# EAGLE design electrosteel2020_10_arrange6_synthboardsonlyrev6 (EAGLE 9.6.2)

## Sheet 1 of 2
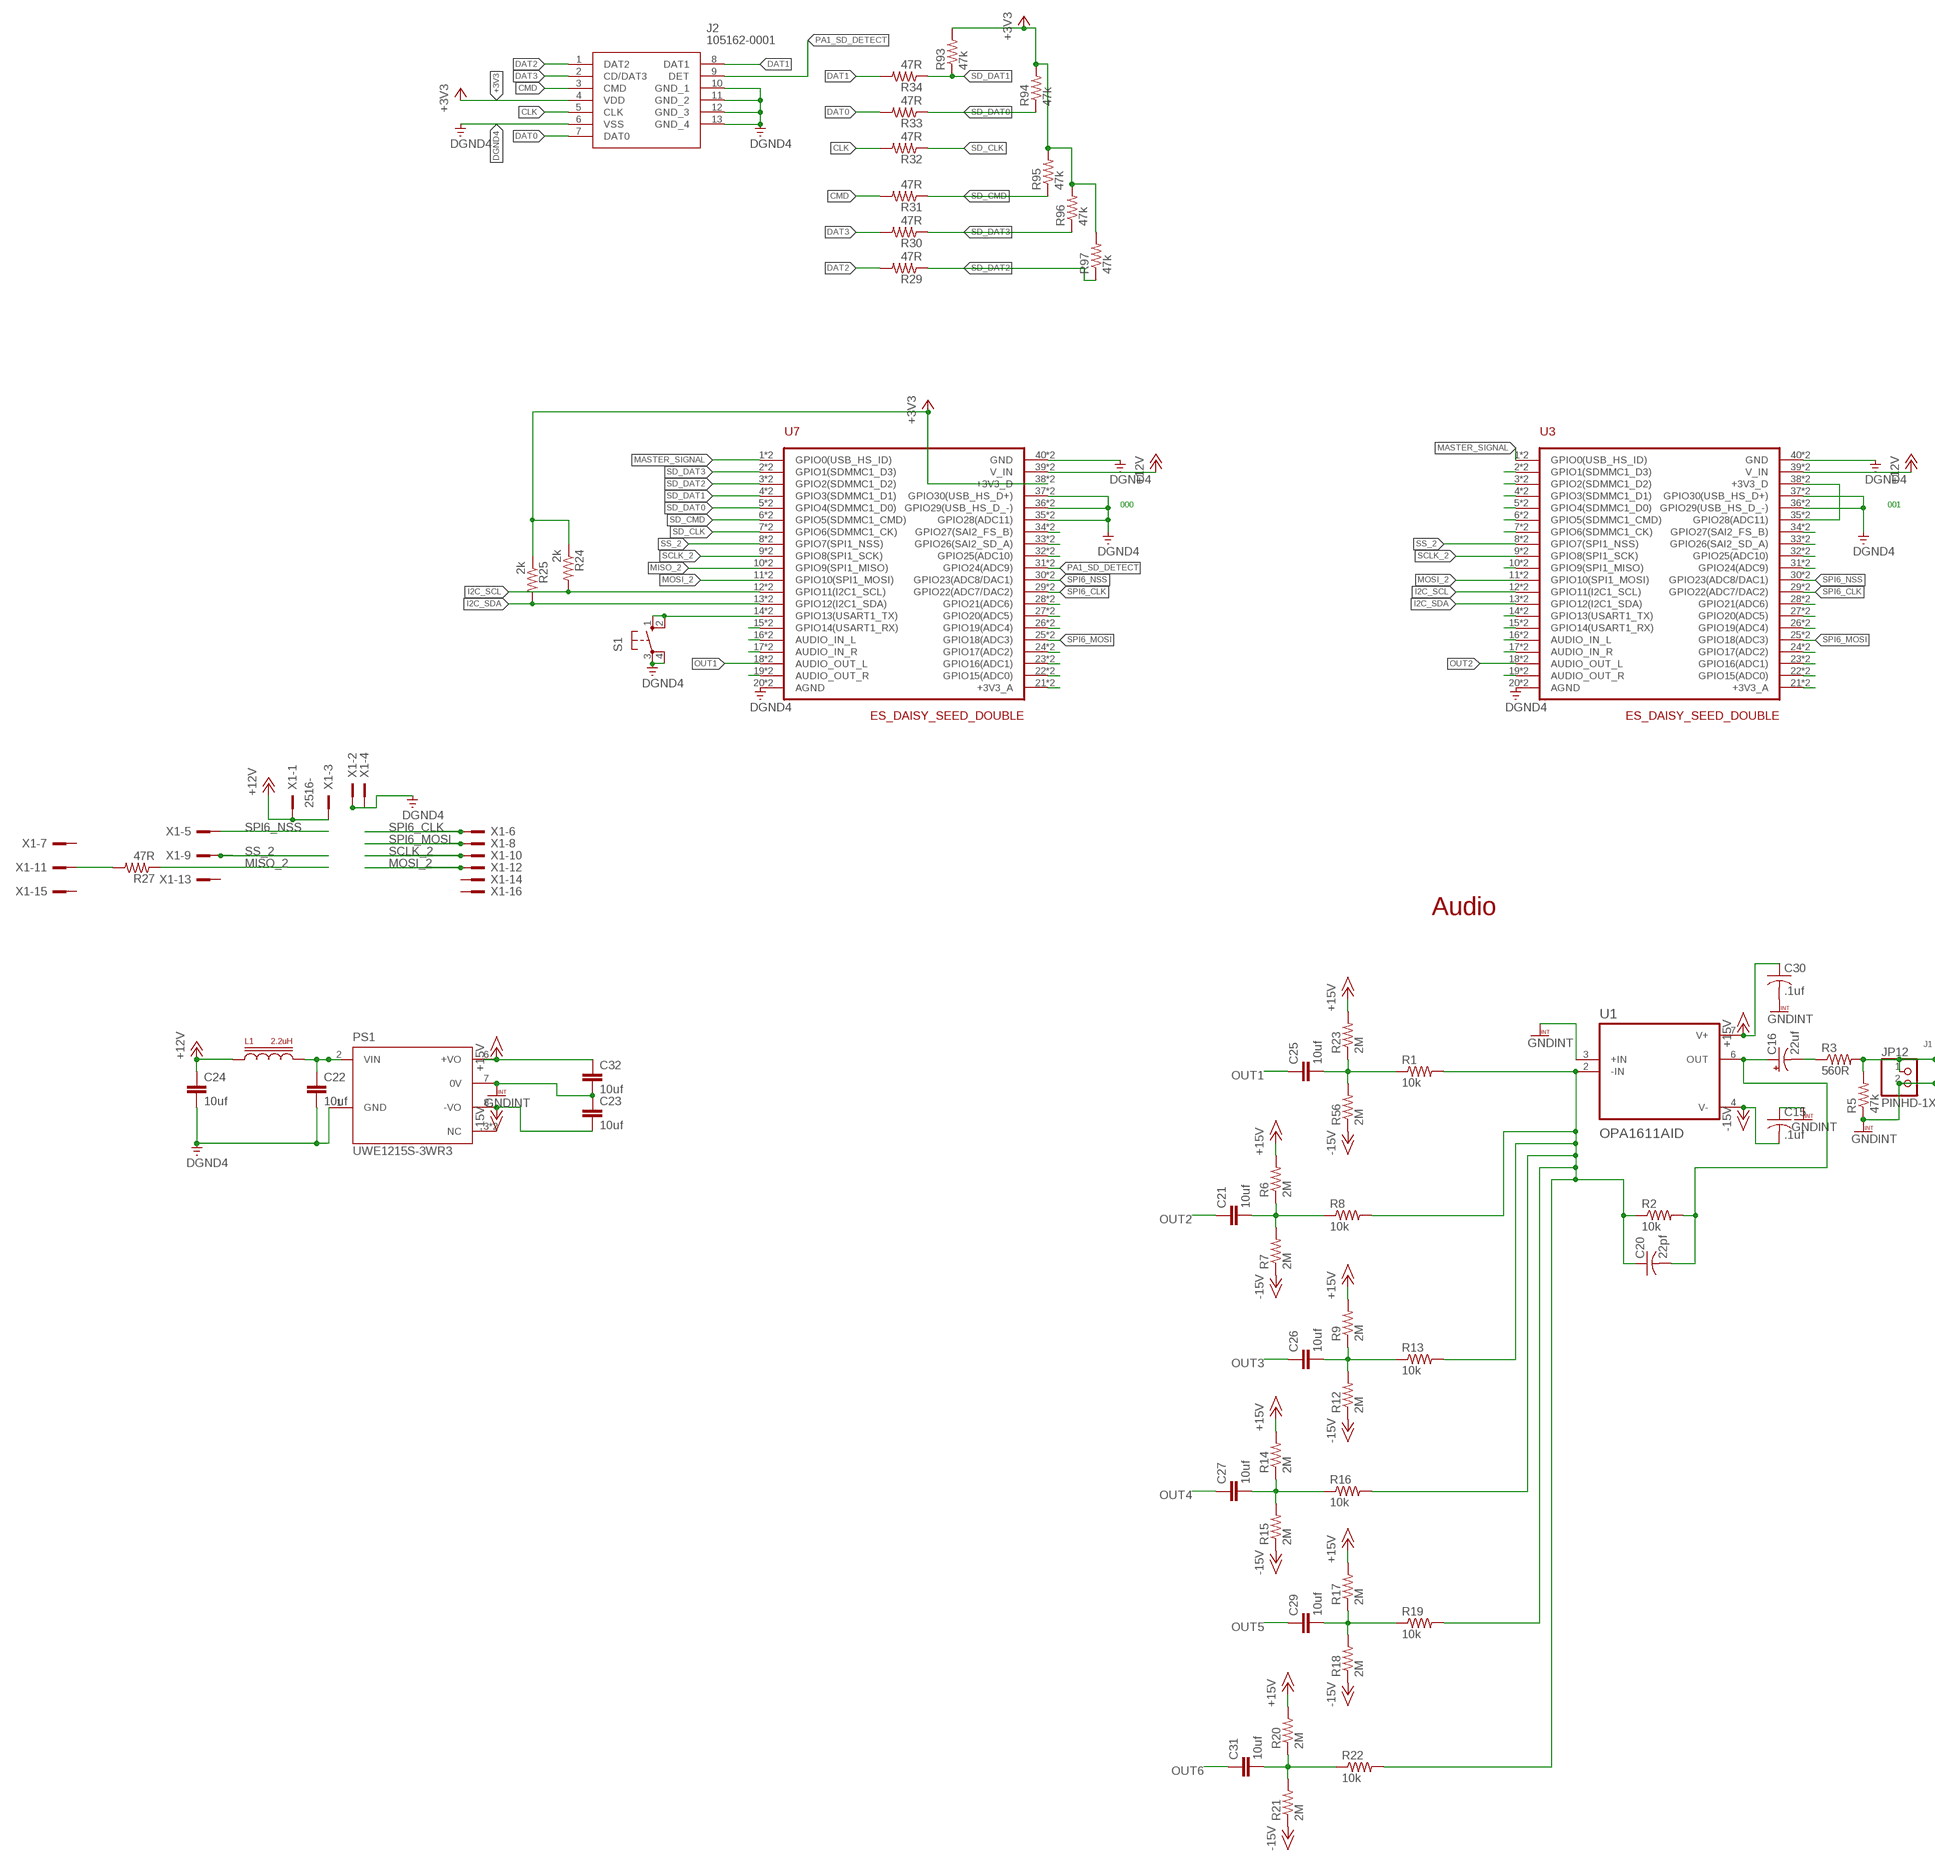
[diagram p0: schematic, sheet 1, part 1 of 2]
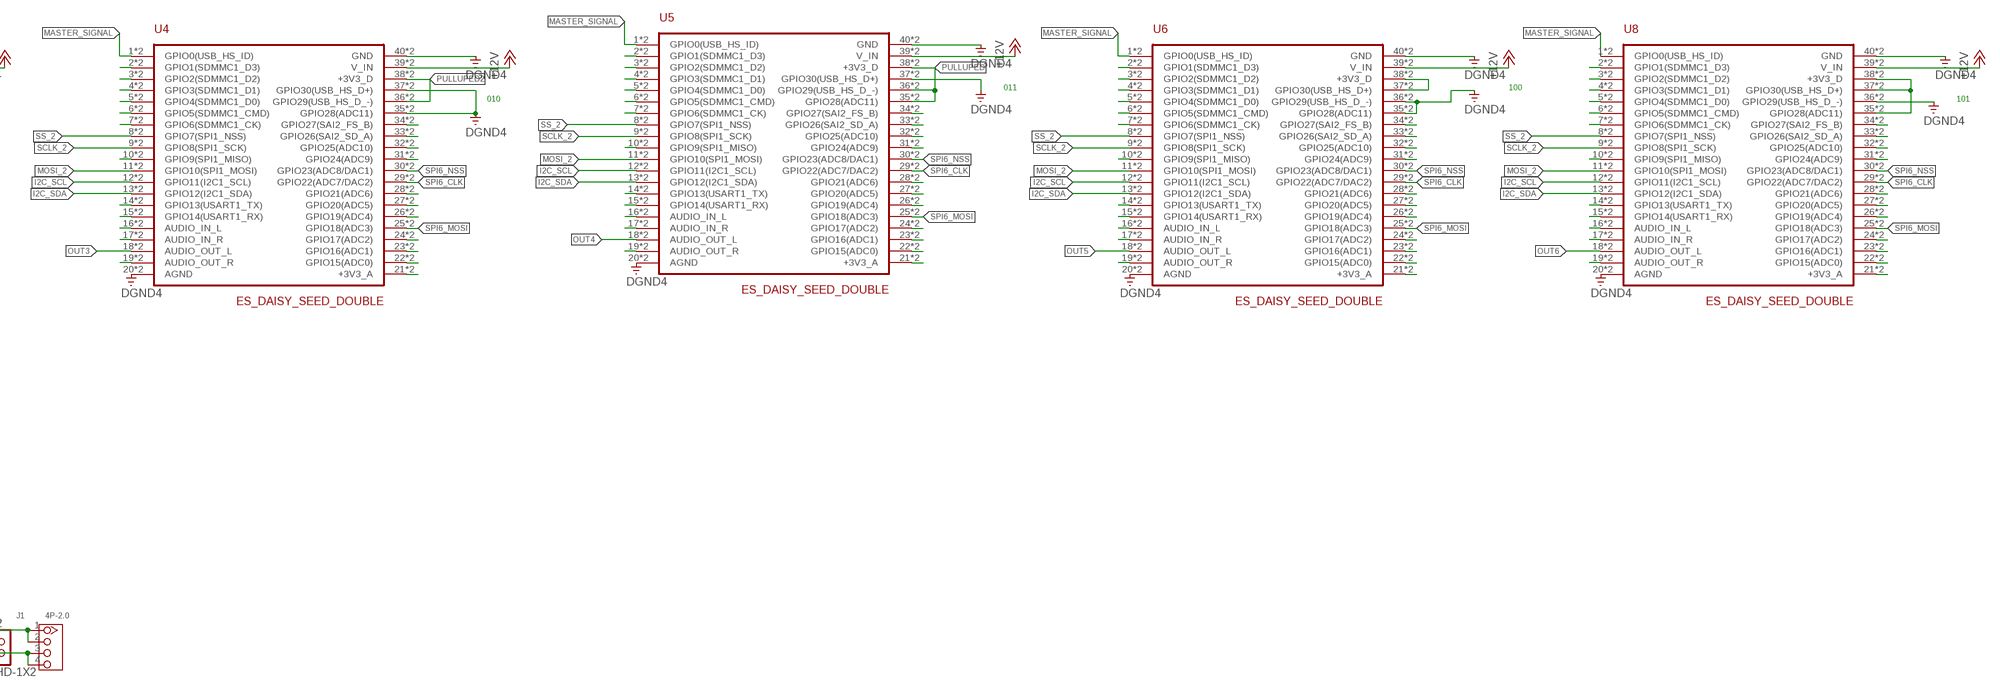
[diagram p1: schematic, sheet 1, part 2 of 2]

### Parts
C15  .1uf  C-USC0603K  [C0603K]
C16  22uf  CPOL-USD  [PANASONIC_D]
C20  22pf  C-USC0603  [C0603]
C21  10uf  C-EUC1206K  [C1206K]
C22  10uf  C-EUC1206K  [C1206K]
C23  10uf  C-EUC1206K  [C1206K]
C24  10uf  C-EUC1206K  [C1206K]
C25  10uf  C-EUC1206K  [C1206K]
C26  10uf  C-EUC1206K  [C1206K]
C27  10uf  C-EUC1206K  [C1206K]
C29  10uf  C-EUC1206K  [C1206K]
C30  .1uf  C-USC0603K  [C0603K]
C31  10uf  C-EUC1206K  [C1206K]
C32  10uf  C-EUC1206K  [C1206K]
J1  4P-2.0  GROVE-CONNECTOR-DIP(4P-2.0)  [HW4-2.0]
J2  105162-0001  [105162-0001]
JP12  PINHD-1X2  [1X02]
L1  2.2uH  INDUCTORS  [BOURNS_SRP2010]
PS1  UWE1215S-3WR3  [CONV_UWE1215S-3WR3]
R1  10k  R-US_R0603  [R0603]
R2  10k  R-US_R0603  [R0603]
R3  560R  R-US_R0603  [R0603]
R5  47k  R-US_R0603  [R0603]
R6  2M  R-US_R0603  [R0603]
R7  2M  R-US_R0603  [R0603]
R8  10k  R-US_R0603  [R0603]
R9  2M  R-US_R0603  [R0603]
R12  2M  R-US_R0603  [R0603]
R13  10k  R-US_R0603  [R0603]
R14  2M  R-US_R0603  [R0603]
R15  2M  R-US_R0603  [R0603]
R16  10k  R-US_R0603  [R0603]
R17  2M  R-US_R0603  [R0603]
R18  2M  R-US_R0603  [R0603]
R19  10k  R-US_R0603  [R0603]
R20  2M  R-US_R0603  [R0603]
R21  2M  R-US_R0603  [R0603]
R22  10k  R-US_R0603  [R0603]
R23  2M  R-US_R0603  [R0603]
R24  2k  R-US_R0603  [R0603]
R25  2k  R-US_R0603  [R0603]
R27  47R  R-US_R0603  [R0603]
R29  47R  R-US_R0603  [R0603]
R30  47R  R-US_R0603  [R0603]
R31  47R  R-US_R0603  [R0603]
R32  47R  R-US_R0603  [R0603]
R33  47R  R-US_R0603  [R0603]
R34  47R  R-US_R0603  [R0603]
R56  2M  R-US_R0603  [R0603]
R93  47k  R-US_R0603  [R0603]
R94  47k  R-US_R0603  [R0603]
R95  47k  R-US_R0603  [R0603]
R96  47k  R-US_R0603  [R0603]
R97  47k  R-US_R0603  [R0603]
S1  10-XX  [B3F-10XX]
U1  OPA1611AID  [SOIC127P599X175-8N]
U3  ES_DAISY_SEED_DOUBLE  [ES_DAISY_SEED_DOUBLE]
U4  ES_DAISY_SEED_DOUBLE  [ES_DAISY_SEED_DOUBLE]
U5  ES_DAISY_SEED_DOUBLE  [ES_DAISY_SEED_DOUBLE]
U6  ES_DAISY_SEED_DOUBLE  [ES_DAISY_SEED_DOUBLE]
U7  ES_DAISY_SEED_DOUBLE  [ES_DAISY_SEED_DOUBLE]
U8  ES_DAISY_SEED_DOUBLE  [ES_DAISY_SEED_DOUBLE]
X1  2516-  [PAK100/2500-16]

### Nets
+3V3: J2.4(VDD) R24.1 R25.1 R93.2 R94.2 R95.2 R96.2 R97.2 U7.38(+3V3_D) U7.B38(+3V3_D)
+12V: C24.1 L1.P$1 U3.39(V_IN) U3.B39(V_IN) U4.39(V_IN) U4.B39(V_IN) U5.39(V_IN) U5.B39(V_IN) U6.39(V_IN) U6.B39(V_IN) U7.39(V_IN) U7.B39(V_IN) U8.39(V_IN) U8.B39(V_IN) X1.1 X1.3
+15V: C30.1 C32.1 PS1.6(+VO) R6.2 R9.2 R14.2 R17.2 R20.2 R23.2 U1.7(V+)
-15V: C15.2 C23.2 PS1.8(-VO) R7.1 R12.1 R15.1 R18.1 R21.1 R56.1 U1.4(V-)
CLK: J2.5(CLK) R32.2
CMD: J2.3(CMD) R31.2
DAT0: J2.7(DAT0) R33.2
DAT1: J2.8(DAT1) R34.2
DAT2: J2.1(DAT2) R29.2
DAT3: J2.2(CD/DAT3) R30.2
DGND4: C22.2 C24.2 J2.6(VSS) J2.10(GND_1) J2.11(GND_2) J2.12(GND_3) J2.13(GND_4) PS1.1(GND) S1.3(P) S1.4(P1) U3.20(AGND) U3.36(GPIO29(USB_HS_D_-)) U3.37(GPIO30(USB_HS_D+)) U3.40(GND) U3.B20(AGND) U3.B36(GPIO29(USB_HS_D_-)) U3.B37(GPIO30(USB_HS_D+)) U3.B40(GND) U4.20(AGND) U4.35(GPIO28(ADC11)) U4.37(GPIO30(USB_HS_D+)) U4.40(GND) U4.B20(AGND) U4.B35(GPIO28(ADC11)) U4.B37(GPIO30(USB_HS_D+)) U4.B40(GND) U5.20(AGND) U5.37(GPIO30(USB_HS_D+)) U5.40(GND) U5.B20(AGND) U5.B37(GPIO30(USB_HS_D+)) U5.B40(GND) U6.20(AGND) U6.35(GPIO28(ADC11)) U6.36(GPIO29(USB_HS_D_-)) U6.40(GND) U6.B20(AGND) U6.B35(GPIO28(ADC11)) U6.B36(GPIO29(USB_HS_D_-)) U6.B40(GND) U7.20(AGND) U7.35(GPIO28(ADC11)) U7.36(GPIO29(USB_HS_D_-)) U7.37(GPIO30(USB_HS_D+)) U7.40(GND) U7.B20(AGND) U7.B35(GPIO28(ADC11)) U7.B36(GPIO29(USB_HS_D_-)) U7.B37(GPIO30(USB_HS_D+)) U7.B40(GND) U8.20(AGND) U8.36(GPIO29(USB_HS_D_-)) U8.40(GND) U8.B20(AGND) U8.B36(GPIO29(USB_HS_D_-)) U8.B40(GND) X1.2 X1.4
GNDINT: C15.1 C23.1 C30.2 C32.2 J1.3 J1.4 JP12.2 PS1.7(0V) R5.1 U1.3(+IN)
I2C_SCL: R24.2 U3.12(GPIO11(I2C1_SCL)) U3.B12(GPIO11(I2C1_SCL)) U4.12(GPIO11(I2C1_SCL)) U4.B12(GPIO11(I2C1_SCL)) U5.12(GPIO11(I2C1_SCL)) U5.B12(GPIO11(I2C1_SCL)) U6.12(GPIO11(I2C1_SCL)) U6.B12(GPIO11(I2C1_SCL)) U7.12(GPIO11(I2C1_SCL)) U7.B12(GPIO11(I2C1_SCL)) U8.12(GPIO11(I2C1_SCL)) U8.B12(GPIO11(I2C1_SCL))
I2C_SDA: R25.2 U3.13(GPIO12(I2C1_SDA)) U3.B13(GPIO12(I2C1_SDA)) U4.13(GPIO12(I2C1_SDA)) U4.B13(GPIO12(I2C1_SDA)) U5.13(GPIO12(I2C1_SDA)) U5.B13(GPIO12(I2C1_SDA)) U6.13(GPIO12(I2C1_SDA)) U6.B13(GPIO12(I2C1_SDA)) U7.13(GPIO12(I2C1_SDA)) U7.B13(GPIO12(I2C1_SDA)) U8.13(GPIO12(I2C1_SDA)) U8.B13(GPIO12(I2C1_SDA))
MASTER_SIGNAL: U3.1(GPIO0(USB_HS_ID)) U3.B1(GPIO0(USB_HS_ID)) U4.1(GPIO0(USB_HS_ID)) U4.B1(GPIO0(USB_HS_ID)) U5.1(GPIO0(USB_HS_ID)) U5.B1(GPIO0(USB_HS_ID)) U6.1(GPIO0(USB_HS_ID)) U6.B1(GPIO0(USB_HS_ID)) U7.1(GPIO0(USB_HS_ID)) U7.B1(GPIO0(USB_HS_ID)) U8.1(GPIO0(USB_HS_ID)) U8.B1(GPIO0(USB_HS_ID))
MISO_2: R27.1 U7.10(GPIO9(SPI1_MISO)) U7.B10(GPIO9(SPI1_MISO))
MISO_2_P1: U3.10(GPIO9(SPI1_MISO)) U3.B10(GPIO9(SPI1_MISO))
MISO_2_P2: U4.10(GPIO9(SPI1_MISO)) U4.B10(GPIO9(SPI1_MISO))
MISO_2_P3: U5.10(GPIO9(SPI1_MISO)) U5.B10(GPIO9(SPI1_MISO))
MISO_2_P4: U6.10(GPIO9(SPI1_MISO)) U6.B10(GPIO9(SPI1_MISO))
MISO_2_P5: U8.10(GPIO9(SPI1_MISO)) U8.B10(GPIO9(SPI1_MISO))
MONO_OUTPUT: C16.+ C20.2 R2.2 U1.6(OUT)
MOSI_2: U3.11(GPIO10(SPI1_MOSI)) U3.B11(GPIO10(SPI1_MOSI)) U4.11(GPIO10(SPI1_MOSI)) U4.B11(GPIO10(SPI1_MOSI)) U5.11(GPIO10(SPI1_MOSI)) U5.B11(GPIO10(SPI1_MOSI)) U6.11(GPIO10(SPI1_MOSI)) U6.B11(GPIO10(SPI1_MOSI)) U7.11(GPIO10(SPI1_MOSI)) U7.B11(GPIO10(SPI1_MOSI)) U8.11(GPIO10(SPI1_MOSI)) U8.B11(GPIO10(SPI1_MOSI)) X1.12
N$1: U5.31(GPIO24(ADC9)) U5.B31(GPIO24(ADC9))
N$2: C21.2 R6.1 R7.2 R8.1
N$3: U6.31(GPIO24(ADC9)) U6.B31(GPIO24(ADC9))
N$4: C20.1 R1.2 R2.1 R8.2 R13.2 R16.2 R19.2 R22.2 U1.2(-IN)
N$5: C16.- R3.1
N$6: J1.1 J1.2 JP12.1 R3.2 R5.2
N$7: C25.2 R1.1 R23.1 R56.2
N$8: C26.2 R9.1 R12.2 R13.1
N$9: C27.2 R14.1 R15.2 R16.1
N$10: C29.2 R17.1 R18.2 R19.1
N$11: C31.2 R20.1 R21.2 R22.1
N$12: U7.19(AUDIO_OUT_R) U7.B19(AUDIO_OUT_R)
N$13: U7.17(AUDIO_IN_R) U7.B17(AUDIO_IN_R)
N$14: U7.16(AUDIO_IN_L) U7.B16(AUDIO_IN_L)
N$15: U7.15(GPIO14(USART1_RX)) U7.B15(GPIO14(USART1_RX))
N$17: U8.31(GPIO24(ADC9)) U8.B31(GPIO24(ADC9))
N$18: U8.26(GPIO19(ADC4)) U8.B26(GPIO19(ADC4))
N$19: U6.26(GPIO19(ADC4)) U6.B26(GPIO19(ADC4))
N$20: U7.34(GPIO27(SAI2_FS_B)) U7.B34(GPIO27(SAI2_FS_B))
N$21: U7.33(GPIO26(SAI2_SD_A)) U7.B33(GPIO26(SAI2_SD_A))
N$22: U7.32(GPIO25(ADC10)) U7.B32(GPIO25(ADC10))
N$23: U5.26(GPIO19(ADC4)) U5.B26(GPIO19(ADC4))
N$24: R27.2 X1.11
N$25: U7.28(GPIO21(ADC6)) U7.B28(GPIO21(ADC6))
N$26: U7.27(GPIO20(ADC5)) U7.B27(GPIO20(ADC5))
N$27: U4.26(GPIO19(ADC4)) U4.B26(GPIO19(ADC4))
N$28: U3.26(GPIO19(ADC4)) U3.B26(GPIO19(ADC4))
N$29: U3.21(+3V3_A) U3.B21(+3V3_A)
N$30: U7.24(GPIO17(ADC2)) U7.B24(GPIO17(ADC2))
N$31: U7.23(GPIO16(ADC1)) U7.B23(GPIO16(ADC1))
N$32: U7.22(GPIO15(ADC0)) U7.B22(GPIO15(ADC0))
N$33: U3.19(AUDIO_OUT_R) U3.B19(AUDIO_OUT_R)
N$34: U3.17(AUDIO_IN_R) U3.B17(AUDIO_IN_R)
N$35: U3.16(AUDIO_IN_L) U3.B16(AUDIO_IN_L)
N$36: U3.15(GPIO14(USART1_RX)) U3.B15(GPIO14(USART1_RX))
N$37: U3.14(GPIO13(USART1_TX)) U3.B14(GPIO13(USART1_TX))
N$38: U7.26(GPIO19(ADC4)) U7.B26(GPIO19(ADC4))
N$39: U3.35(GPIO28(ADC11)) U3.38(+3V3_D) U3.B35(GPIO28(ADC11)) U3.B38(+3V3_D)
N$40: U3.34(GPIO27(SAI2_FS_B)) U3.B34(GPIO27(SAI2_FS_B))
N$41: U3.33(GPIO26(SAI2_SD_A)) U3.B33(GPIO26(SAI2_SD_A))
N$42: U3.32(GPIO25(ADC10)) U3.B32(GPIO25(ADC10))
N$43: U3.28(GPIO21(ADC6)) U3.B28(GPIO21(ADC6))
N$44: U3.27(GPIO20(ADC5)) U3.B27(GPIO20(ADC5))
N$45: U7.21(+3V3_A) U7.B21(+3V3_A)
N$46: U3.24(GPIO17(ADC2)) U3.B24(GPIO17(ADC2))
N$47: U3.23(GPIO16(ADC1)) U3.B23(GPIO16(ADC1))
N$48: U3.22(GPIO15(ADC0)) U3.B22(GPIO15(ADC0))
N$49: U4.21(+3V3_A) U4.B21(+3V3_A)
N$50: U4.19(AUDIO_OUT_R) U4.B19(AUDIO_OUT_R)
N$51: U4.17(AUDIO_IN_R) U4.B17(AUDIO_IN_R)
N$52: U4.16(AUDIO_IN_L) U4.B16(AUDIO_IN_L)
N$53: U4.15(GPIO14(USART1_RX)) U4.B15(GPIO14(USART1_RX))
N$54: U4.14(GPIO13(USART1_TX)) U4.B14(GPIO13(USART1_TX))
N$55: S1.1(S) S1.2(S1) U7.14(GPIO13(USART1_TX)) U7.B14(GPIO13(USART1_TX))
N$56: U3.2(GPIO1(SDMMC1_D3)) U3.B2(GPIO1(SDMMC1_D3))
N$57: U4.34(GPIO27(SAI2_FS_B)) U4.B34(GPIO27(SAI2_FS_B))
N$58: U4.33(GPIO26(SAI2_SD_A)) U4.B33(GPIO26(SAI2_SD_A))
N$59: U4.32(GPIO25(ADC10)) U4.B32(GPIO25(ADC10))
N$60: U4.28(GPIO21(ADC6)) U4.B28(GPIO21(ADC6))
N$61: U4.27(GPIO20(ADC5)) U4.B27(GPIO20(ADC5))
N$62: U4.24(GPIO17(ADC2)) U4.B24(GPIO17(ADC2))
N$63: U4.23(GPIO16(ADC1)) U4.B23(GPIO16(ADC1))
N$64: U4.22(GPIO15(ADC0)) U4.B22(GPIO15(ADC0))
N$65: U5.21(+3V3_A) U5.B21(+3V3_A)
N$66: U5.19(AUDIO_OUT_R) U5.B19(AUDIO_OUT_R)
N$67: U5.17(AUDIO_IN_R) U5.B17(AUDIO_IN_R)
N$68: U5.16(AUDIO_IN_L) U5.B16(AUDIO_IN_L)
N$69: U5.15(GPIO14(USART1_RX)) U5.B15(GPIO14(USART1_RX))
N$70: U5.14(GPIO13(USART1_TX)) U5.B14(GPIO13(USART1_TX))
N$71: U3.3(GPIO2(SDMMC1_D2)) U3.B3(GPIO2(SDMMC1_D2))
N$72: U3.4(GPIO3(SDMMC1_D1)) U3.B4(GPIO3(SDMMC1_D1))
N$73: U5.34(GPIO27(SAI2_FS_B)) U5.B34(GPIO27(SAI2_FS_B))
N$74: U5.33(GPIO26(SAI2_SD_A)) U5.B33(GPIO26(SAI2_SD_A))
N$75: U5.32(GPIO25(ADC10)) U5.B32(GPIO25(ADC10))
N$76: U5.28(GPIO21(ADC6)) U5.B28(GPIO21(ADC6))
N$77: U5.27(GPIO20(ADC5)) U5.B27(GPIO20(ADC5))
N$78: U5.24(GPIO17(ADC2)) U5.B24(GPIO17(ADC2))
N$79: U5.23(GPIO16(ADC1)) U5.B23(GPIO16(ADC1))
N$80: U5.22(GPIO15(ADC0)) U5.B22(GPIO15(ADC0))
N$81: C22.1 L1.P$2 PS1.2(VIN)
N$82: U6.21(+3V3_A) U6.B21(+3V3_A)
N$83: U6.19(AUDIO_OUT_R) U6.B19(AUDIO_OUT_R)
N$84: U6.17(AUDIO_IN_R) U6.B17(AUDIO_IN_R)
N$85: U6.16(AUDIO_IN_L) U6.B16(AUDIO_IN_L)
N$86: U6.15(GPIO14(USART1_RX)) U6.B15(GPIO14(USART1_RX))
N$87: U6.14(GPIO13(USART1_TX)) U6.B14(GPIO13(USART1_TX))
N$88: U6.37(GPIO30(USB_HS_D+)) U6.38(+3V3_D) U6.B37(GPIO30(USB_HS_D+)) U6.B38(+3V3_D)
N$89: U3.5(GPIO4(SDMMC1_D0)) U3.B5(GPIO4(SDMMC1_D0))
N$90: U6.34(GPIO27(SAI2_FS_B)) U6.B34(GPIO27(SAI2_FS_B))
N$91: U6.33(GPIO26(SAI2_SD_A)) U6.B33(GPIO26(SAI2_SD_A))
N$92: U6.32(GPIO25(ADC10)) U6.B32(GPIO25(ADC10))
N$93: U6.28(GPIO21(ADC6)) U6.B28(GPIO21(ADC6))
N$94: U6.27(GPIO20(ADC5)) U6.B27(GPIO20(ADC5))
N$95: U6.24(GPIO17(ADC2)) U6.B24(GPIO17(ADC2))
N$96: U6.23(GPIO16(ADC1)) U6.B23(GPIO16(ADC1))
N$97: U6.22(GPIO15(ADC0)) U6.B22(GPIO15(ADC0))
N$98: U8.21(+3V3_A) U8.B21(+3V3_A)
N$99: U8.19(AUDIO_OUT_R) U8.B19(AUDIO_OUT_R)
N$100: U8.17(AUDIO_IN_R) U8.B17(AUDIO_IN_R)
N$101: U8.16(AUDIO_IN_L) U8.B16(AUDIO_IN_L)
N$102: U8.15(GPIO14(USART1_RX)) U8.B15(GPIO14(USART1_RX))
N$103: U8.14(GPIO13(USART1_TX)) U8.B14(GPIO13(USART1_TX))
N$104: U8.35(GPIO28(ADC11)) U8.37(GPIO30(USB_HS_D+)) U8.38(+3V3_D) U8.B35(GPIO28(ADC11)) U8.B37(GPIO30(USB_HS_D+)) U8.B38(+3V3_D)
N$105: U3.6(GPIO5(SDMMC1_CMD)) U3.B6(GPIO5(SDMMC1_CMD))
N$106: U3.7(GPIO6(SDMMC1_CK)) U3.B7(GPIO6(SDMMC1_CK))
N$108: U8.34(GPIO27(SAI2_FS_B)) U8.B34(GPIO27(SAI2_FS_B))
N$109: U8.33(GPIO26(SAI2_SD_A)) U8.B33(GPIO26(SAI2_SD_A))
N$110: U8.32(GPIO25(ADC10)) U8.B32(GPIO25(ADC10))
N$111: U8.28(GPIO21(ADC6)) U8.B28(GPIO21(ADC6))
N$112: U8.27(GPIO20(ADC5)) U8.B27(GPIO20(ADC5))
N$113: U8.24(GPIO17(ADC2)) U8.B24(GPIO17(ADC2))
N$114: U8.23(GPIO16(ADC1)) U8.B23(GPIO16(ADC1))
N$115: U8.22(GPIO15(ADC0)) U8.B22(GPIO15(ADC0))
N$116: U4.2(GPIO1(SDMMC1_D3)) U4.B2(GPIO1(SDMMC1_D3))
N$117: U4.3(GPIO2(SDMMC1_D2)) U4.B3(GPIO2(SDMMC1_D2))
N$118: U4.4(GPIO3(SDMMC1_D1)) U4.B4(GPIO3(SDMMC1_D1))
N$119: U4.5(GPIO4(SDMMC1_D0)) U4.B5(GPIO4(SDMMC1_D0))
N$120: U4.6(GPIO5(SDMMC1_CMD)) U4.B6(GPIO5(SDMMC1_CMD))
N$121: U4.7(GPIO6(SDMMC1_CK)) U4.B7(GPIO6(SDMMC1_CK))
N$123: U5.2(GPIO1(SDMMC1_D3)) U5.B2(GPIO1(SDMMC1_D3))
N$124: U5.3(GPIO2(SDMMC1_D2)) U5.B3(GPIO2(SDMMC1_D2))
N$125: U5.4(GPIO3(SDMMC1_D1)) U5.B4(GPIO3(SDMMC1_D1))
N$126: U5.5(GPIO4(SDMMC1_D0)) U5.B5(GPIO4(SDMMC1_D0))
N$127: U5.6(GPIO5(SDMMC1_CMD)) U5.B6(GPIO5(SDMMC1_CMD))
N$128: U5.7(GPIO6(SDMMC1_CK)) U5.B7(GPIO6(SDMMC1_CK))
N$130: U6.2(GPIO1(SDMMC1_D3)) U6.B2(GPIO1(SDMMC1_D3))
N$131: U6.3(GPIO2(SDMMC1_D2)) U6.B3(GPIO2(SDMMC1_D2))
N$132: U6.4(GPIO3(SDMMC1_D1)) U6.B4(GPIO3(SDMMC1_D1))
N$133: U6.5(GPIO4(SDMMC1_D0)) U6.B5(GPIO4(SDMMC1_D0))
N$134: U6.6(GPIO5(SDMMC1_CMD)) U6.B6(GPIO5(SDMMC1_CMD))
N$135: U6.7(GPIO6(SDMMC1_CK)) U6.B7(GPIO6(SDMMC1_CK))
N$136: U8.2(GPIO1(SDMMC1_D3)) U8.B2(GPIO1(SDMMC1_D3))
N$137: U8.3(GPIO2(SDMMC1_D2)) U8.B3(GPIO2(SDMMC1_D2))
N$138: U8.4(GPIO3(SDMMC1_D1)) U8.B4(GPIO3(SDMMC1_D1))
N$139: U8.5(GPIO4(SDMMC1_D0)) U8.B5(GPIO4(SDMMC1_D0))
N$140: U8.6(GPIO5(SDMMC1_CMD)) U8.B6(GPIO5(SDMMC1_CMD))
N$141: U8.7(GPIO6(SDMMC1_CK)) U8.B7(GPIO6(SDMMC1_CK))
OUT1: C25.1 U7.18(AUDIO_OUT_L) U7.B18(AUDIO_OUT_L)
OUT2: C21.1 U3.18(AUDIO_OUT_L) U3.B18(AUDIO_OUT_L)
OUT3: C26.1 U4.18(AUDIO_OUT_L) U4.B18(AUDIO_OUT_L)
OUT4: C27.1 U5.18(AUDIO_OUT_L) U5.B18(AUDIO_OUT_L)
OUT5: C29.1 U6.18(AUDIO_OUT_L) U6.B18(AUDIO_OUT_L)
OUT6: C31.1 U8.18(AUDIO_OUT_L) U8.B18(AUDIO_OUT_L)
PA1_SD_DETECT: J2.9(DET) U3.31(GPIO24(ADC9)) U3.B31(GPIO24(ADC9)) U7.31(GPIO24(ADC9)) U7.B31(GPIO24(ADC9))
PA1_SD_DETECT1: U4.31(GPIO24(ADC9)) U4.B31(GPIO24(ADC9))
PULLUPED: U5.35(GPIO28(ADC11)) U5.36(GPIO29(USB_HS_D_-)) U5.38(+3V3_D) U5.B35(GPIO28(ADC11)) U5.B36(GPIO29(USB_HS_D_-)) U5.B38(+3V3_D)
PULLUPED2: U4.36(GPIO29(USB_HS_D_-)) U4.38(+3V3_D) U4.B36(GPIO29(USB_HS_D_-)) U4.B38(+3V3_D)
SCLK_2: U3.9(GPIO8(SPI1_SCK)) U3.B9(GPIO8(SPI1_SCK)) U4.9(GPIO8(SPI1_SCK)) U4.B9(GPIO8(SPI1_SCK)) U5.9(GPIO8(SPI1_SCK)) U5.B9(GPIO8(SPI1_SCK)) U6.9(GPIO8(SPI1_SCK)) U6.B9(GPIO8(SPI1_SCK)) U7.9(GPIO8(SPI1_SCK)) U7.B9(GPIO8(SPI1_SCK)) U8.9(GPIO8(SPI1_SCK)) U8.B9(GPIO8(SPI1_SCK)) X1.10
SD_CLK: R32.1 U7.7(GPIO6(SDMMC1_CK)) U7.B7(GPIO6(SDMMC1_CK))
SD_CMD: R31.1 R95.1 U7.6(GPIO5(SDMMC1_CMD)) U7.B6(GPIO5(SDMMC1_CMD))
SD_DAT0: R33.1 R94.1 U7.5(GPIO4(SDMMC1_D0)) U7.B5(GPIO4(SDMMC1_D0))
SD_DAT1: R34.1 R93.1 U7.4(GPIO3(SDMMC1_D1)) U7.B4(GPIO3(SDMMC1_D1))
SD_DAT2: R29.1 R97.1 U7.3(GPIO2(SDMMC1_D2)) U7.B3(GPIO2(SDMMC1_D2))
SD_DAT3: R30.1 R96.1 U7.2(GPIO1(SDMMC1_D3)) U7.B2(GPIO1(SDMMC1_D3))
SPI6_CLK: U3.29(GPIO22(ADC7/DAC2)) U3.B29(GPIO22(ADC7/DAC2)) U4.29(GPIO22(ADC7/DAC2)) U4.B29(GPIO22(ADC7/DAC2)) U5.29(GPIO22(ADC7/DAC2)) U5.B29(GPIO22(ADC7/DAC2)) U6.29(GPIO22(ADC7/DAC2)) U6.B29(GPIO22(ADC7/DAC2)) U7.29(GPIO22(ADC7/DAC2)) U7.B29(GPIO22(ADC7/DAC2)) U8.29(GPIO22(ADC7/DAC2)) U8.B29(GPIO22(ADC7/DAC2)) X1.6
SPI6_MOSI: U3.25(GPIO18(ADC3)) U3.B25(GPIO18(ADC3)) U4.25(GPIO18(ADC3)) U4.B25(GPIO18(ADC3)) U5.25(GPIO18(ADC3)) U5.B25(GPIO18(ADC3)) U6.25(GPIO18(ADC3)) U6.B25(GPIO18(ADC3)) U7.25(GPIO18(ADC3)) U7.B25(GPIO18(ADC3)) U8.25(GPIO18(ADC3)) U8.B25(GPIO18(ADC3)) X1.8
SPI6_NSS: U3.30(GPIO23(ADC8/DAC1)) U3.B30(GPIO23(ADC8/DAC1)) U4.30(GPIO23(ADC8/DAC1)) U4.B30(GPIO23(ADC8/DAC1)) U5.30(GPIO23(ADC8/DAC1)) U5.B30(GPIO23(ADC8/DAC1)) U6.30(GPIO23(ADC8/DAC1)) U6.B30(GPIO23(ADC8/DAC1)) U7.30(GPIO23(ADC8/DAC1)) U7.B30(GPIO23(ADC8/DAC1)) U8.30(GPIO23(ADC8/DAC1)) U8.B30(GPIO23(ADC8/DAC1)) X1.5
SS_2: U3.8(GPIO7(SPI1_NSS)) U3.B8(GPIO7(SPI1_NSS)) U4.8(GPIO7(SPI1_NSS)) U4.B8(GPIO7(SPI1_NSS)) U5.8(GPIO7(SPI1_NSS)) U5.B8(GPIO7(SPI1_NSS)) U6.8(GPIO7(SPI1_NSS)) U6.B8(GPIO7(SPI1_NSS)) U7.8(GPIO7(SPI1_NSS)) U7.B8(GPIO7(SPI1_NSS)) U8.8(GPIO7(SPI1_NSS)) U8.B8(GPIO7(SPI1_NSS)) X1.9
Unconnected: PS1.3(NC) PS1.5(NC) X1.7 X1.13 X1.14 X1.15 X1.16

### Notes on the sheet
- 011 | 100
- 000 | 001 | 010 | 101
- Audio

## Sheet 2 of 2

## Library data of the parts
C15 C30 = rcl:C-US: CAPACITOR, American symbol; PARTNO: CC0603KRX7R8BB104
C16 = adafruit:CPOL-US: POLARIZED CAPACITOR, American symbol; PARTNO: EEE-1CA220NP
C20 = rcl:C-US: CAPACITOR, American symbol; PARTNO: CC0603JRNPO9BN220; SPICEPREFIX: C
C21-C27 C29 C31 C32 = rcl:C-EU: CAPACITOR, European symbol; PARTNO: TMK316F106ZL-T
J1 = OPL_Connector:GROVE-CONNECTOR-DIP(4P-2.0): 320110033; PARTNO: 110990030
J2 = 105162-0001:105162-0001: Memory Card Connectors 1.45H MICRO SD HEADER WITH D/C PIN Source: Datasheet <http://www.molex.com/webdocs/datasheets/pdf/en-us//1051620001_MEMORY_CARD_SOCKET.pdf> Check prices <https://pricing.snapeda.com/parts/1051620001/Molex/view-part?ref=eda>; AVAILABILITY: In Stock; DESCRIPTION: 9 (8 + 1) Position Card Connector Secure Digital - microSD™ Surface Mount, Right Angle Gold; MF: Molex; MP: 1051620001; PACKAGE: None; PARTNO: 105162-0001; PRICE: None; PURCHASE-URL: https://pricing.snapeda.com/search/part/1051620001/?ref=eda
JP12 = Connector:PINHD-1X2: PIN HEADER; CATEGORY: CONNECTOR; PARTNO: *DNP; SUB-CATEGORY: PIN-HEADER
L1 = Electrosmith-Passives:INDUCTOR; PARTNO: SRP2010-2R2M
PS1 = UWE1215S-3WR3:UWE1215S-3WR3: DC/DC Converter; DESCRIPTION: Isolated Module DC DC Converter 2 Output 15V -15V - - 100mA, 100mA 4.5V - 36V Input; DIGI-KEY_PART_NUMBER: 2725-UWE1215S-3WR3-ND; MF: Mornsun America, LLC; MP: UWE1215S-3WR3; PACKAGE: SIP-7-7 MORNSUN; PARTNO: UWE1215S-3WR3; PURCHASE-URL: https://pricing.snapeda.com/search/part/UWE1215S-3WR3/?ref=eda
R1 R2 R8 R13 R16 R19 R22 = Resistor:R-US_: RESISTOR, American symbol; PARTNO: ESR03EZPF1002
R3 = Resistor:R-US_: RESISTOR, American symbol; PARTNO: ESR03EZPF5600
R5 = Resistor:R-US_: RESISTOR, American symbol; PARTNO: ESR03EZPJ473
R6 R7 R9 R12 R14 R15 R17 R18 R20 R21 R23 R56 = Electrosmith-Passives:R-US_: RESISTOR, American symbol; PACKAGE: R0603; PARTNO: RMCF0603FT2M00
R24 R25 = rcl:R-US_: RESISTOR, American symbol; PARTNO: ERJ-PA3F2001V; SPICEPREFIX: R
R27 R29-R34 = rcl:R-US_: RESISTOR, American symbol; PARTNO: RC0603JR-0747RL; SPICEPREFIX: R
R93-R97 = rcl:R-US_: RESISTOR, American symbol; PARTNO: ESR03EZPJ473
S1 = switch-omron:10-XX: OMRON SWITCH; MPN: B3F-1000; OC_FARNELL: 176432; OC_NEWARK: 36M3542
U1 = OPA1611AID:OPA1611AID; DESCRIPTION: 1.1nV/√Hz Noise, Low Power, Precision Operational Amplifier; DIGI-KEY_PART_NUMBER: 296-24958-5-ND; MF: Texas Instruments; MP: OPA1611AID; PACKAGE: SOIC-8 Texas Instruments; PARTNO: OPA1611AID; PURCHASE-URL: https://pricing.snapeda.com/search/part/OPA1611AID/?ref=eda
U3-U8 = Electrosmith_Boards:ES_DAISY_SEED; PARTNO: 4840-6004-CP
X1 = con-3m:2516-: 3M (TM) Pak 100 4-Wall Header Source: 3M; OC_FARNELL: unknown; OC_NEWARK: unknown; PARTNO: SBH11-PBPC-D08-ST-BK

## Board
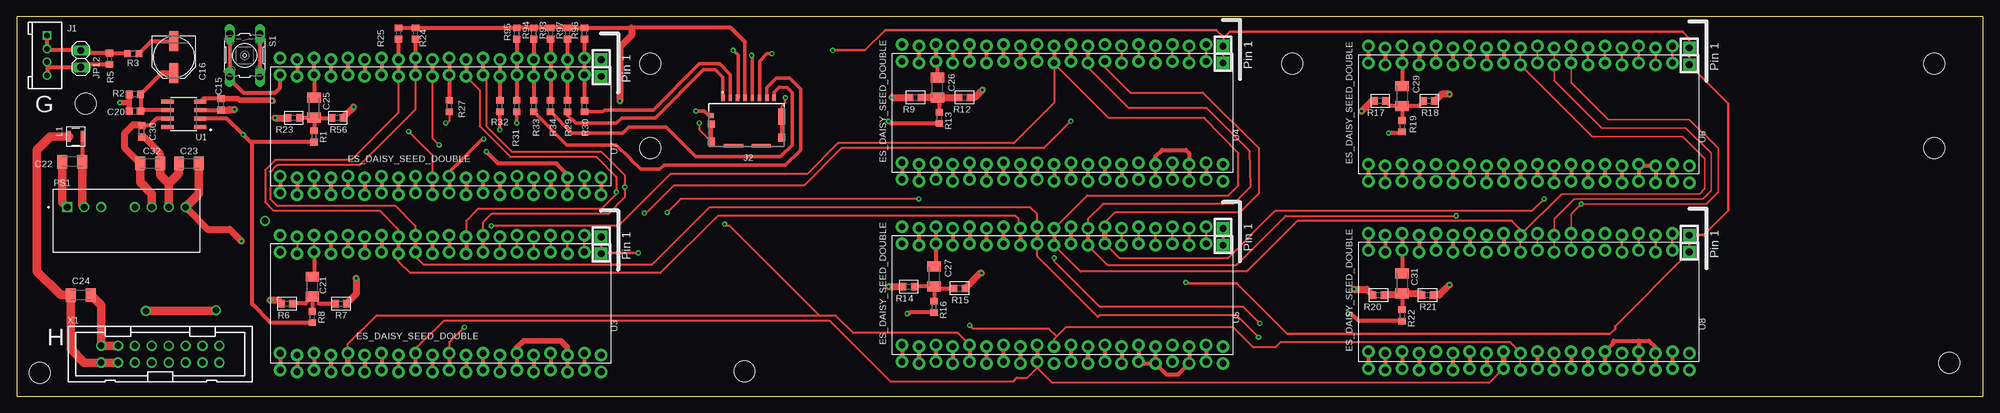
[diagram p2: board, top side]
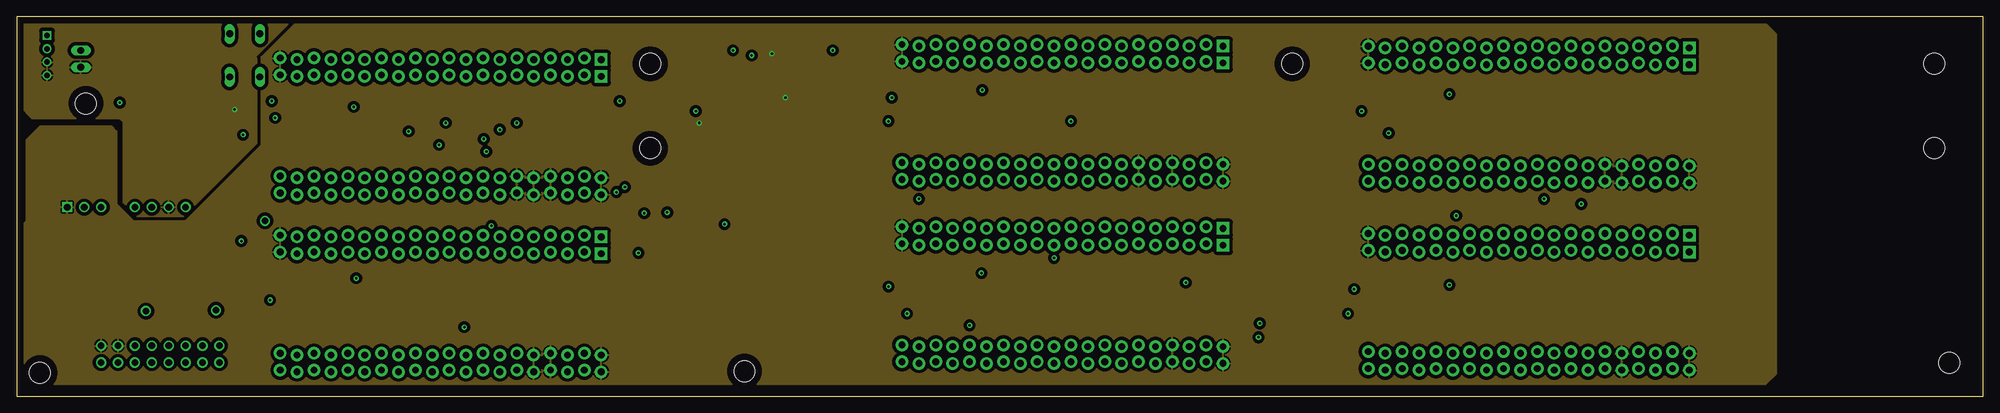
[diagram p3: board, inner layer Route2]
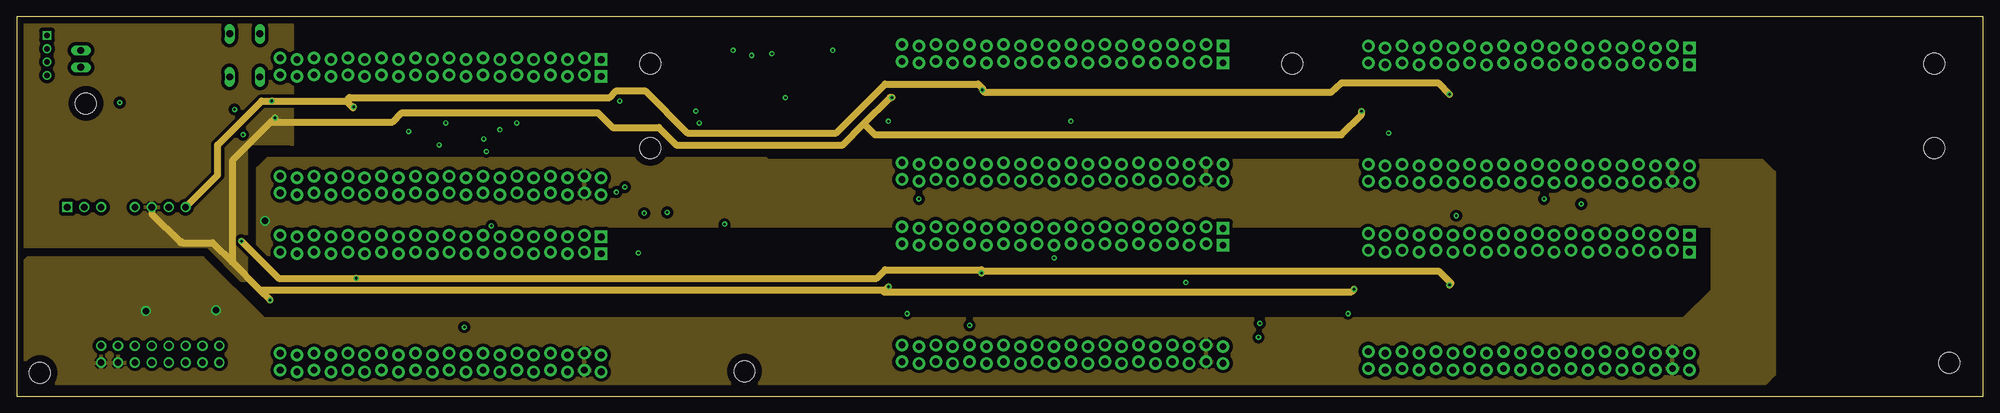
[diagram p4: board, inner layer Route15]
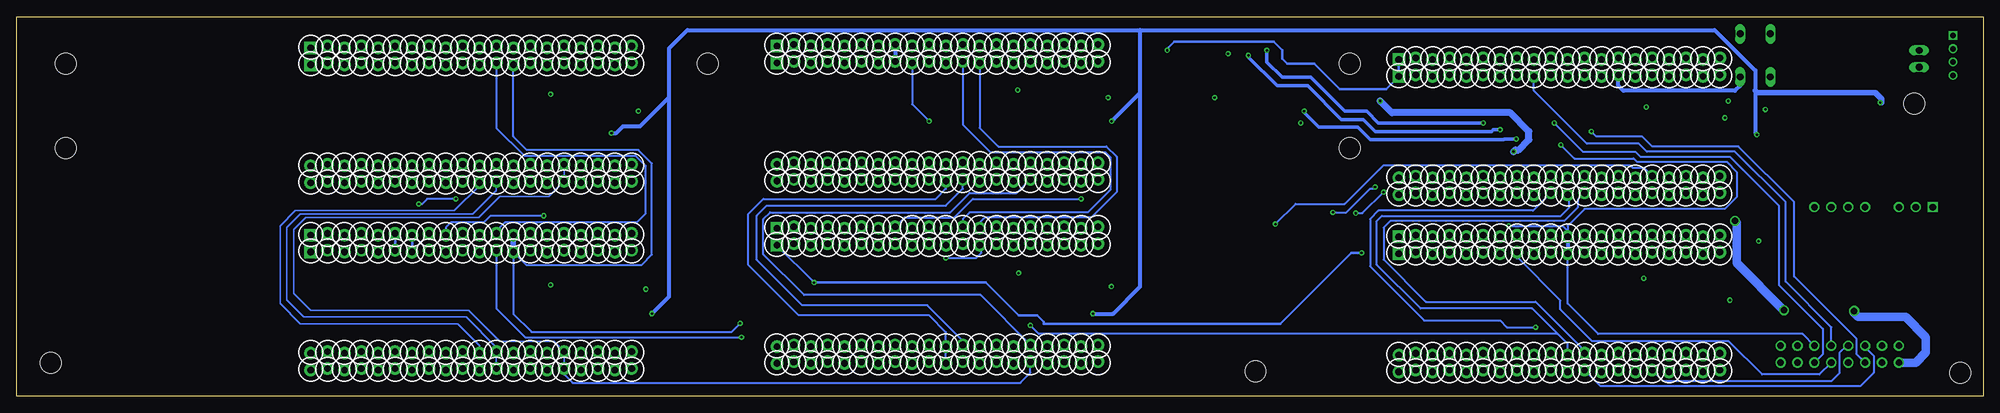
[diagram p5: board, bottom side, seen from below]

Size 295.66 x 57.15 mm. Coordinates in mm from the lower left corner, seen from the top.
Outline: 0,57.15 0,0 295.66,0 295.66,57.15 0,57.15
Copper layers (1+2*15+16): Top 0.035mm / dielectric 0.5mm / Route2 0.035mm / dielectric 0.5mm / Route15 0.035mm / dielectric 0.5mm / Bottom 0.035mm
Design rules "default *": minimum track width 6mil, minimum drill 13mil, track to track 9mil, track to pad 9mil, pad to pad 9mil, via to via 9mil, smd to smd 9mil, copper to edge 40mil, drill to drill 6mil, minimum pad ring 10mil, minimum via ring 8mil, stop-mask expansion 4mil, vias tented up to drill 0mil, thermal gap 10mil
Holes 3.17 mm at 95.25,37.34 288.29,37.34 10.41,44.07 290.53,5.05 109.42,3.78 3.51,3.53 288.29,50.04 191.77,50.04 95.25,50.04

### Footprints (pad centres in the part's own frame; a part is rotated, then mirrored left to right if it is on the bottom)
C0603K = smd 1.05 x 1.08: 1 -0.875,0; 2 0.875,0
PANASONIC_D = smd 3 x 1.4: + 2.4,0; - -2.4,0
C0603 = smd 1.1 x 1: 1 -0.85,0; 2 0.85,0
C1206K = smd 1.5 x 2: 1 -1.5,0; 2 1.5,0
HW4-2.0 = drill 0.8 pad 1.27 square: 1 -3,0 | drill 0.8 pad 1.27: 2 -1,0; 3 1,0; 4 3,0
105162-0001 = smd 0.5 x 1: 1 3.55,-7.34; 2 2.45,-7.34; 3 1.35,-7.34; 4 0.25,-7.34; 5 -0.85,-7.34; 6 -1.95,-7.34; 7 -3.05,-7.34; 8 -4.15,-7.34 | smd 0.72 x 0.78: 9 5.31,-4.66 | smd 1.05 x 1.08: 10 5.325,-3.39 | smd 1.05 x 1.2: 11 5.325,-0.78; 12 -5.325,-1.35 | smd 1.05 x 2.39: 13 -5.325,-4.535 | smd 2.91 x 0.55: 14 1.986,-0.105; 15 -2.204,-0.105
1X02 = drill 1.016 long: 1 -1.27,0; 2 1.27,0
BOURNS_SRP2010 = smd 0.559 x 1.6: P$1 -1.003,0; P$2 1.003,0
CONV_UWE1215S-3WR3 = drill 1 square: 1 -8.89,2.05 | drill 1: 2 -6.35,2.05; 3 -3.81,2.05; 5 1.27,2.05; 6 3.81,2.05; 7 6.35,2.05; 8 8.89,2.05
R0603 = smd 1 x 1.1: 1 -0.85,0; 2 0.85,0
B3F-10XX = drill 1.016 long: 1 -3.251,2.261; 2 3.251,2.261; 3 -3.251,-2.261; 4 3.251,-2.261
SOIC127P599X175-8N = smd 1.97 x 0.6: 1 -2.47,1.905; 2 -2.47,0.635; 3 -2.47,-0.635; 4 -2.47,-1.905; 5 2.47,-1.905; 6 2.47,-0.635; 7 2.47,0.635; 8 2.47,1.905
ES_DAISY_SEED_DOUBLE = drill 1.016 pad 1.88 square: 1 -7.493,24.13; B1 -10.033,24.13 | drill 1.016 pad 1.88: 2 -7.747,21.59; 3 -7.493,19.05; 4 -7.747,16.51; 5 -7.493,13.97; 6 -7.747,11.43; 7 -7.493,8.89; 8 -7.747,6.35; 9 -7.493,3.81; 10 -7.747,1.27; 11 -7.493,-1.27; 12 -7.747,-3.81; 13 -7.493,-6.35; 14 -7.747,-8.89; 15 -7.493,-11.43; 16 -7.747,-13.97; 17 -7.493,-16.51; 18 -7.747,-19.05; 19 -7.493,-21.59; 20 -7.747,-24.13; 21 7.493,-24.13; 22 7.747,-21.59; 23 7.493,-19.05; 24 7.747,-16.51; 25 7.493,-13.97; 26 7.747,-11.43; 27 7.493,-8.89; 28 7.747,-6.35; 29 7.493,-3.81; 30 7.747,-1.27; 31 7.493,1.27; 32 7.747,3.81; 33 7.493,6.35; 34 7.747,8.89; 35 7.493,11.43; 36 7.747,13.97; 37 7.493,16.51; 38 7.747,19.05; 39 7.493,21.59; 40 7.747,24.13; B2 -10.287,21.59; B3 -10.033,19.05; B4 -10.287,16.51; B5 -10.033,13.97; B6 -10.287,11.43; B7 -10.033,8.89; B8 -10.287,6.35; B9 -10.033,3.81; B10 -10.287,1.27; B11 -10.033,-1.27; B12 -10.287,-3.81; B13 -10.033,-6.35; B14 -10.287,-8.89; B15 -10.033,-11.43; B16 -10.287,-13.97; B17 -10.033,-16.51; B18 -10.287,-19.05; B19 -10.033,-21.59; B20 -10.287,-24.13; B21 10.033,-24.13; B22 10.287,-21.59; B23 10.033,-19.05; B24 10.287,-16.51; B25 10.033,-13.97; B26 10.287,-11.43; B27 10.033,-8.89; B28 10.287,-6.35; B29 10.033,-3.81; B30 10.287,-1.27; B31 10.033,1.27; B32 10.287,3.81; B33 10.033,6.35; B34 10.287,8.89; B35 10.033,11.43; B36 10.287,13.97; B37 10.033,16.51; B38 10.287,19.05; B39 10.033,21.59; B40 10.287,24.13
PAK100/2500-16 = drill 1 pad 1.422: 1 -8.89,-1.27; 2 -8.89,1.27; 3 -6.35,-1.27; 4 -6.35,1.27; 5 -3.81,-1.27; 6 -3.81,1.27; 7 -1.27,-1.27; 8 -1.27,1.27; 9 1.27,-1.27; 10 1.27,1.27; 11 3.81,-1.27; 12 3.81,1.27; 13 6.35,-1.27; 14 6.35,1.27; 15 8.89,-1.27; 16 8.89,1.27

### Placement (x,y rotation side)
C15  30.73,43.94 90 top
C16  23.62,51.05 270 top
C20  17.78,42.93 0 top
C21  44.45,16.51 270 top
C22  8.38,35.31 180 top
C23  25.91,35.05 0 top
C24  9.65,15.24 0 top
C25  44.7,43.43 270 top
C26  138.43,46.48 270 top
C27  137.92,18.03 270 top
C29  208.28,45.21 270 top
C30  18.8,39.88 270 top
C31  208.28,17.02 270 top
C32  20.07,35.05 0 top
J1  4.57,51.31 270 top
J2  109.73,37.59 180 top
JP12  9.65,50.8 270 top
L1  8.89,39.12 0 top
PS1  16.51,26.42 0 top
R1  44.7,39.12 270 top
R2  17.78,45.47 0 top
R3  17.53,51.56 180 top
R5  13.97,50.8 90 top
R6  40.64,13.97 180 top
R7  48.77,13.97 180 top
R8  44.45,11.94 270 top
R9  135.13,44.96 180 top
R12  142.49,44.96 180 top
R13  138.68,41.91 270 top
R14  134.11,16.51 180 top
R15  141.73,16.26 180 top
R16  137.92,13.46 270 top
R17  204.98,44.45 180 top
R18  212.34,44.45 180 top
R19  208.28,40.64 270 top
R20  204.72,15.24 180 top
R21  212.09,15.24 180 top
R22  208.28,12.19 270 top
R23  41.66,41.91 180 top
R24  59.94,54.61 270 top
R25  57.4,54.61 270 top
R27  65.02,43.69 270 top
R29  82.8,43.69 270 top
R30  85.34,43.69 270 top
R31  75.18,43.69 270 top
R32  72.64,43.69 270 top
R33  77.72,43.69 270 top
R34  80.26,43.69 270 top
R56  48.26,41.91 180 top
R93  80.26,54.61 90 top
R94  77.72,54.61 90 top
R95  75.18,54.61 90 top
R96  85.34,54.61 90 top
R97  82.8,54.61 90 top
S1  34.29,51.31 270 top
U1  25.15,42.42 180 top
U3  63.75,13.97 270 top
U4  157.23,42.67 270 top
U5  157.23,15.24 270 top
U6  227.33,42.42 270 top
U7  63.75,40.64 270 top
U8  227.33,14.22 270 top
X1  21.59,6.35 0 top

### Tracks (layer width: path | path; a pad name or v marks a point on that pad's centre or on a via)
+3V3  (via drill 0.35)
  Top 0.508: J2.4 109.47,53.34
  Top 0.61: R25.1 R24.1 R95.2 R94.2 R93.2 80.43,55.63 82.64,55.63 R97.2 R96.2 92.46,55.46 107.35,55.46 109.47,53.34 | U7.B38 U7.38 82.8,33.4 81.15,35.05 72.39,35.05 v70.61,36.83 | J2.4
  Top 1.016: 92.46,55.46 92.46,54.36 90.68,52.58 v90.68,44.45
  Bottom 1.016: v70.61,36.83 70.36,37.08 69.85,37.08 68.33,38.61 68.33,39.88 71.12,42.67 88.9,42.67 v90.68,44.45
+12V  (via drill 1)
  Top 0.61: U7.39 U7.B39 | U3.39 U3.B39 | U5.39 U5.B39 | U4.39 U4.B39 | U6.39 U6.B39 | U8.39 U8.B39
  Top 1.27: L1.P$1 5.08,39.12 3.05,37.08 3.05,18.8 6.6,15.24 C24.1 8.15,7.14 8.13,7.11 10.16,5.08 X1.1 X1.3 | v19.43,12.83 29.84,12.83 v29.97,12.95
  Bottom 1.27: X1.1 10.16,5.08 8.64,6.6 8.64,8.89 11.68,11.94 18.8,11.94 19.56,12.7 v19.43,12.83 | v29.97,12.95 37.08,20.07 37.08,26.16 v37.34,26.42
  pour Route15 (isolate 0.508): 1.78,20.83 27.94,20.83 37.13,11.64 250.65,11.64 254.97,15.95 254.97,25.61 38.66,25.61 38.66,21.64 38.1,21.08 36.32,22.86 36.32,34.29 37.85,35.81 112.52,35.81 112.82,35.51 262.33,35.51 264.16,33.69 264.16,3.3 262.84,1.98 0.56,1.98 0.51,2.03 0.51,19.56
+15V  (via drill 0.35)
  Top 0.61: U1.7 20.95,41.78 19.93,40.75 C30.1
  Top 1.016: v38.1,14.48 39.28,14.48 R6.2 | v131.07,16.52 131.08,16.51 R14.2 | v201.06,16.13 202.99,16.13 R20.2 | v38.86,41.91 R23.2 | v131.57,44.96 R9.2 | v202.18,42.93 203.71,44.45 R17.2 | C32.1 16.26,37.36 16.26,39.62 17.53,40.89 18.66,40.89 C30.1
  Top 1.27: C32.1 18.57,32.23 20.32,30.48 PS1.6
  Route15 1.016: PS1.6 20.32,27.45 24.65,23.12 24.77,23.25 24.91,23.11 29.46,23.11 32.38,20.19 | 32.38,20.19 36.58,16 | 36.58,16 v38.1,14.48 | 36.58,16 130.56,16 | 130.56,16 130.3,15.75 200.68,15.75 v201.06,16.13 | 130.56,16 v131.07,16.52 | 32.38,20.19 32.51,20.32 32.51,35.56 38.23,41.27 | 38.23,41.27 v38.86,41.91 | 38.23,41.27 56.52,41.27 57.91,42.67 87.38,42.67 89.6,40.45 96.54,40.45 99.14,37.85 124.21,37.85 127.38,41.02 | v131.57,44.96 131.32,44.96 127.38,41.02 | 127.38,41.02 129.03,39.37 199.14,39.37 202.18,42.42 v202.18,42.93
  pour Route15 (isolate 0.508): 0.76,56.64 0.76,22.61 28.7,22.61 33.78,17.53 34.54,17.53 34.54,38.1 41.15,38.1 41.4,37.85 41.4,55.88 1.52,55.88
-15V  (via drill 0.35)
  Top 0.61: C15.2 28.11,44.82 U1.4
  Top 0.813: C15.2 33.27,44.82 33.53,44.56 38.49,44.56 38.61,44.45 v38.35,44.45
  Top 1.016: v50.67,43.56 49.11,42 R56.1 | v145.16,46.1 144.02,44.96 R12.1 | v215.39,45.47 214.21,45.47 R18.1 | PS1.8 28.72,25.15 32,25.15 v33.78,23.37 | v51.05,17.78 51.05,15.41 R7.1 | v145.03,18.54 144.87,18.54 R15.1 | v215.39,16.76 213.87,15.24 R21.1
  Top 1.27: C23.2 27.41,30.47 PS1.8
  Route15 1.016: PS1.8 30.23,33.29 30.23,37.85 36.83,44.45 v38.35,44.45 49.53,44.45 | 49.53,44.45 50.55,43.43 v50.67,43.56 | 49.53,44.45 50.04,44.96 89.15,44.96 90.17,45.97 94.49,45.97 100.84,39.62 123.19,39.62 130.56,46.99 144.53,46.99 145.29,46.23 v145.16,46.1 145.54,45.72 197.53,45.72 199.2,47.2 213.68,47.18 v215.39,45.47 | v33.78,23.37 39.37,17.78 v51.05,17.78 129.29,17.78 130.56,19.05 145.03,19.05 145.29,18.8 | 145.29,18.8 v145.03,18.54 | 145.29,18.8 213.87,18.8 215.65,17.02 v215.39,16.76
CLK  (via drill 0.35)
  Top 0.508: 110.58,51.22 J2.5 | R32.2 v72.64,40.13
  Top 0.61: v110.49,51.31 110.58,51.22
  Bottom 0.508: v72.64,40.13 73.66,40.13 73.91,39.88 91.44,39.88 93.22,41.66 96.52,41.66 101.6,46.74 106.17,46.74 110.49,51.05
  Bottom 0.61: 110.49,51.05 v110.49,51.31
CMD  (via drill 0.35)
  Top 0.508: v107.7,52.07 108.46,51.31 108.46,45.01 | R31.2 v75.18,41.15
  Top 0.61: J2.3 108.46,45.01
  Bottom 0.508: v75.18,41.15 90.93,41.15 92.71,42.93 96.01,42.93 101.09,48.01 105.41,48.01 107.7,50.29 v107.7,52.07
DAT0
  Top 0.508: R33.2 82.72,37.85 90.17,37.85 92.34,35.67 92.34,35.62 93.79,34.18 96.71,34.18 97.33,34.8 115.57,34.8 117.86,37.08 117.86,46.23 116.2,47.88 114.17,47.88 112.78,46.48 J2.7
DAT1
  Top 0.508: R34.2 83.48,39.62 91.14,39.62 92.01,40.5 97.68,40.5 102.11,36.07 114.81,36.07 116.59,37.85 116.59,45.72 115.82,46.49 114.63,46.5 113.88,45.75 J2.8
DAT2
  Top 0.508: R29.2 82.8,42.33 83.48,41.66 83.57,41.66 84.07,41.15 90.17,41.15 90.93,41.91 96.01,41.91 103.24,49.14 105.04,49.14 106.17,48.01 106.18,47.73 J2.1
DAT3
  Top 0.508: R30.2 88.14,42.84 88.39,43.09 95.67,43.09 102.62,50.04 105.66,50.04 107.28,48.42 J2.2
DGND4  (via drill 0.35)
  Top 0.305: v115.57,44.96 115.57,44.2 115.05,43.68 J2.13 | v102.62,41.15 102.62,40.16 J2.11
  Top 0.508: J2.10 J2.11 | J2.12 J2.13 | J2.6 111.68,50.46 112.78,51.56 v113.54,51.56
  Top 0.61: U7.35 U7.B35 | U7.36 U7.B36 | U7.37 U7.B37 | U7.40 U7.B40 | U3.37 U3.B37 | U3.36 U3.B36 | U4.37 U4.B37 | U6.B20 U6.20 | U6.36 U6.B36 | U6.35 U6.B35 | U8.B20 U8.20 | S1.3 S1.4 32.03,47.73 34.04,45.72 38.86,45.72 39.62,46.48 U7.20
  Top 1.27: C22.2 6.88,29.2 PS1.1 | C24.2 12.7,13.69 X1.2 X1.4
  pour Route2 (isolate 0.508): 1.52,26.42 1.52,38.61 3.56,40.64 14.22,40.64 14.99,39.88 14.99,28.96 17.53,26.42 25.4,26.42 36.83,37.85 36.83,51.05 42.93,57.15 261.87,57.15 264.41,54.61 264.41,3.3 262.89,1.78 0.25,1.78 0.25,25.15
GNDINT  (via drill 0.35)
  Top 0.61: U1.3 27.63,43.07 C15.1 | R5.1 10.07,49.95 JP12.2 4.84,49.53 4.57,49.8 J1.3 J1.4
  Top 1.016: C30.2 19.16,39 21.59,36.58 21.59,35.08 C32.2 | C15.1 31.89,43.07 32,43.18 v32.77,43.18
  Top 1.27: C32.2 21.57,33.3 22.86,32 | 22.86,32 PS1.7 | C23.1 24.41,33.55 22.86,32
  pour Route2 (isolate 0.508): 18.03,27.18 25.15,27.18 36.07,38.1 36.07,50.8 35.81,51.05 41.15,56.39 41.15,56.64 0.76,56.64 0.51,56.39 0.51,43.69 2.29,41.91 15.49,41.91 16,41.4 16,29.21
I2C_SCL  (via drill 0.35)
  Top 0.305: v186.69,8.89 183.39,12.19 162.81,12.19 162.56,11.94 153.42,21.08 U5.12 | U5.B12 153.42,27.43 152.4,28.45 104.14,28.45 95.5,19.81 61.21,19.81 59.94,21.08 U3.12 | U7.12 59.94,43.18 51.56,34.8 39.12,34.8 38.1,33.78 38.1,29.72 39.12,28.7 56.9,28.7 59.94,25.65 U3.B12
  Top 0.61: R24.2 U7.B12 U7.12 | U3.B12 U3.12 | U5.B12 U5.12 | U4.B12 U4.12 | U6.B12 U6.12 | U8.B12 U8.12
  Bottom 0.305: U6.12 223.52,40.39 219.38,36.25 202.65,36.25 201.21,34.8 201.17,34.8 201.17,27.43 202.44,26.16 222.25,26.16 223.52,24.89 U8.B12 | U8.12 223.52,13.21 219.2,8.89 v186.69,8.89 | U4.12 153.42,40.89 149.28,36.75 132.04,36.75 131.27,35.98 131.27,31.04 134.62,27.69 152.4,27.69 153.42,26.67 U5.B12
I2C_SDA  (via drill 0.35)
  Top 0.305: v155.96,20.83 155.96,20.32 162.81,13.46 184.4,13.46 v186.9,10.97 | U5.B13 150.62,25.53 150.62,26.67 150.11,27.18 105.41,27.18 96.77,18.54 59.18,18.54 57.4,20.32 U3.13 | U7.13 57.4,42.67 50.29,35.56 38.86,35.56 37.34,34.04 37.34,29.21 38.61,27.94 54.61,27.94 57.4,25.15 U3.B13
  Top 0.61: R25.2 U7.B13 U7.13 | U3.B13 U3.13 | U5.B13 U5.13 | U4.B13 U4.13 | U6.B13 U6.13
  Bottom 0.305: U6.13 220.98,39.12 218.95,37.08 202.18,37.08 200.15,35.05 200.15,21.34 201.68,19.81 219.07,19.81 U8.13 220.98,12.45 218.23,9.7 188.17,9.7 v186.9,10.97 | v155.96,20.83 151.38,20.83 150.62,21.59 150.62,22.48 U5.13 | U4.13 150.88,40.39 148.08,37.59 131.83,37.59 130.3,36.07 130.3,30.73 134.11,26.92 150.11,26.92 150.88,26.16 U5.B13
  Bottom 0.813: U8.B13 U8.13
MASTER_SIGNAL  (via drill 0.35)
  Top 0.406: v122.68,52.07 127.51,52.07 130.56,55.12 180.34,55.12 181.36,54.1 U4.B1 | U4.B1 U4.1 | U4.B1 181.36,53.85 182.37,54.86 250.44,54.86 251.46,53.85 U6.B1 U6.1 257.3,44.07 257.3,27.94 253.62,24.26 U8.B1 U8.1 240.28,10.54 240.28,10.16 239.52,9.4 191.01,9.4 183.39,17.02 175.77,17.02 v175.77,17.12 | v93.47,21.59 88.01,21.59 | 88.01,21.59 U3.1 | U3.B1 87.88,21.72 88.01,21.59 | U5.B1 U5.1
  Bottom 0.406: U7.B1 U7.1 89.79,46.23 96.77,46.23 100.58,50.04 104.65,50.04 105.41,50.8 105.41,52.07 106.68,53.34 121.67,53.34 122.68,52.32 v122.68,52.07 | U5.1 181.36,22.7 v175.77,17.12 149.96,17.12 145.03,12.19 142.24,12.19 141.22,11.18 141.22,10.92 105.66,10.92 95,21.59 v93.47,21.59
MISO_2
  Top 0.61: R27.1 U7.10 U7.B10
MISO_2_P1
  Top 0.61: U3.B10 U3.10
MISO_2_P2
  Top 0.61: U4.B10 U4.10
MISO_2_P3
  Top 0.61: U5.B10 U5.10
MISO_2_P4
  Top 0.254: U6.B10 U6.10
MISO_2_P5
  Top 0.254: U8.B10 U8.10
MONO_OUTPUT
  Top 0.61: 18.76,43.05 18.63,43.18 R2.2 21.82,48.65 | U1.6 18.76,43.05 | 18.76,43.05 C20.2
  Top 0.813: C16.+ 21.82,48.65
MOSI_2  (via drill 0.35)
  Top 0.254: U6.B11 U6.11 236.85,39.12 250.44,39.12 253.75,35.81 253.75,31.24 252.98,30.48 232.28,30.48 U8.B11 U8.11
  Top 0.305: U5.B11 160.91,30.23 182.12,30.23 183.64,31.75 183.67,36.6 178.56,41.91 164.21,41.91 156.02,50.1 U4.11 155.96,44.2 149.86,38.1 123.45,38.1 118.84,33.49 98.26,33.49 90.42,25.65 v71.37,25.65 | U8.B11 226.06,25.15 224.79,26.42 192.53,26.42 184.91,18.8 159.89,18.8 U5.11 | U7.11 62.48,38.86 v63.5,37.85
  Top 0.61: U7.B11 U7.11 | U3.B11 U3.11 | U5.B11 U5.11 | U4.B11 156.02,52.64 156.02,50.1
  Bottom 0.305: X1.12 27.18,9.4 57.91,9.4 62.48,13.97 U3.11 | v63.5,37.85 61.47,35.81 52.58,35.81 52.07,35.31 38.61,35.31 37.08,33.78 37.08,29.97 38.86,28.19 59.94,28.19 62.48,25.65 62.48,24.89 | 62.48,24.89 62.48,23.37 | v71.37,25.65 63.25,25.65 62.48,24.89
  Bottom 0.61: U3.B11 62.48,23.37 U3.11
N$1
  Top 0.61: U5.31 U5.B31
N$2
  Top 0.305: C21.2 45.49,13.97
  Top 0.61: R8.1 C21.2 43.41,13.97 R6.1 | 45.49,13.97 R7.2
N$3
  Top 0.61: U6.31 U6.B31
N$4  (via drill 0.35)
  Top 0.61: R1.2 35.39,38.27 35.39,38.01 | U1.2 31.62,41.78 v34.04,39.37 35.39,38.01 | R8.2 38.19,11.09 35.39,13.88 35.39,38.01 | R19.2 208.11,39.62 v206.25,39.62 | R22.2 201.76,11.34 200.66,12.45 v200.15,12.45 | R16.2 134.28,12.61 134.11,12.45 v133.86,12.45 | R13.2 131.41,41.06 v131.06,41.4
  Top 0.813: R2.1 16.93,44.2 | 16.93,44.2 C20.1 | v15.49,44.2 16.93,44.2
  Bottom 0.61: v206.25,39.62 205.49,39.62 204.47,40.64 201.93,40.64 197.61,44.96 | 126.75,55.12 194.82,55.12 197.61,52.32 197.61,44.96 | 126.75,55.12 40.39,55.12 34.29,49.02 34.29,45.97 34.29,39.62 v34.04,39.37 | v200.15,12.45 197.61,14.99 197.61,44.96 | v133.86,12.45 130.81,12.45 126.75,16.51 126.75,45.72 | 126.75,45.72 126.75,55.12 | v131.06,41.4 126.75,45.72
  Bottom 0.813: 34.29,45.97 34.04,45.72 16.26,45.72 15.24,44.7 15.24,44.2 v15.49,44.2
N$5
  Top 0.61: R3.1 20.27,53.45 C16.-
N$6
  Top 0.61: R3.2 14.06,51.56 R5.2 10.07,51.65 JP12.1 4.81,52.07 J1.2 J1.1
N$7
  Top 0.61: C25.2 R1.1 | C25.2 44.73,41.91 R56.2 | C25.2 44.68,41.91 R23.1
N$8
  Top 0.61: C26.2 138.68,44.73 R13.1
  Top 0.813: C26.2 138.41,44.96
  Top 1.016: 138.41,44.96 R9.1 | C26.2 141.62,44.98 R12.2
N$9
  Top 0.61: C27.2 R16.1 | C27.2 138.2,16.26 R15.2 | C27.2 137.9,16.51 R14.1
N$10
  Top 0.61: C29.2 208.3,43.69 210.73,43.69 R18.2 | C29.2 206.57,43.71 R17.1 | C29.2 R19.1
N$11
  Top 0.61: C31.2 R22.1
  Top 1.016: R20.1 208,15.24 C31.2 210.96,15.52 R21.2
N$12
  Top 0.61: U7.B19 U7.19
N$13
  Top 0.61: U7.B17 U7.17
N$14
  Top 0.61: U7.B16 U7.16
N$15
  Top 0.61: U7.B15 U7.15
N$17
  Top 0.61: U8.31 U8.B31
N$18
  Top 0.61: U8.26 U8.B26
N$19
  Top 0.61: U6.26 U6.B26
N$20
  Top 0.61: U7.34 U7.B34
N$21
  Top 0.61: U7.33 U7.B33
N$22
  Top 0.61: U7.32 U7.B32
N$23
  Top 0.61: U5.26 U5.B26
N$24  (via drill 0.35)
  Top 0.305: R27.2 65.02,41.4 64.77,41.15 v64.52,41.15
  Bottom 0.305: v64.52,41.15 60.2,36.83 52.32,36.83 51.56,36.07 38.1,36.07 30.73,28.7 30.73,16.76 24.13,10.16 24.13,6.35 X1.11
N$25
  Top 0.61: U7.28 U7.B28
N$26
  Top 0.61: U7.27 U7.B27
N$27
  Top 0.61: U4.26 U4.B26
N$28
  Top 0.61: U3.26 U3.B26
N$29
  Top 0.61: U3.21 U3.B21
N$30
  Top 0.61: U7.24 U7.B24
N$31
  Top 0.61: U7.23 U7.B23
N$32
  Top 0.61: U7.22 U7.B22
N$33
  Top 0.305: U3.B19 U3.19
N$34
  Top 0.61: U3.B17 U3.17
N$35
  Top 0.61: U3.B16 U3.16
N$36
  Top 0.61: U3.B15 U3.15
N$37
  Top 0.61: U3.B14 U3.14
N$38
  Top 0.61: U7.26 U7.B26
N$39
  Top 0.61: U3.38 U3.B38 | U3.35 U3.B35
  Top 0.813: U3.38 82.8,7.37 81.79,8.38 76.2,8.38 75.18,7.37 U3.35
N$40
  Top 0.61: U3.34 U3.B34
N$41
  Top 0.61: U3.33 U3.B33
N$42
  Top 0.61: U3.32 U3.B32
N$43
  Top 0.61: U3.28 U3.B28
N$44
  Top 0.61: U3.27 U3.B27
N$45
  Top 0.61: U7.21 U7.B21
N$46
  Top 0.61: U3.24 U3.B24
N$47
  Top 0.61: U3.23 U3.B23
N$48
  Top 0.61: U3.22 U3.B22
N$49
  Top 0.61: U4.21 U4.B21
N$50
  Top 0.61: U4.B19 U4.19
N$51
  Top 0.61: U4.B17 U4.17
N$52
  Top 0.61: U4.B16 U4.16
N$53
  Top 0.61: U4.B15 U4.15
N$54
  Top 0.61: U4.B14 U4.14
N$55
  Top 0.61: U7.B14 U7.14 | S1.1 S1.2
  Bottom 0.61: S1.2 36.58,48.03 36.58,46.74 37.34,45.97 54.1,45.97 54.86,46.74 U7.14
N$56
  Top 0.406: U3.B2 U3.2
N$57
  Top 0.61: U4.34 U4.B34
N$58
  Top 0.61: U4.33 U4.B33
N$59
  Top 0.61: U4.32 U4.B32
N$60
  Top 0.61: U4.28 U4.B28
N$61
  Top 0.61: U4.27 U4.B27
N$62
  Top 0.61: U4.24 U4.B24
N$63
  Top 0.61: U4.23 U4.B23
N$64
  Top 0.61: U4.22 U4.B22
N$65
  Top 0.61: U5.21 U5.B21
N$66
  Top 0.61: U5.B19 U5.19
N$67
  Top 0.61: U5.B17 U5.17
N$68
  Top 0.61: U5.B16 U5.16
N$69
  Top 0.61: U5.B15 U5.15
N$70
  Top 0.61: U5.B14 U5.14
N$71
  Top 0.406: U3.B3 U3.3
N$72
  Top 0.406: U3.B4 U3.4
N$73
  Top 0.61: U5.34 U5.B34
N$74
  Top 0.61: U5.33 U5.B33
N$75
  Top 0.61: U5.32 U5.B32
N$76
  Top 0.61: U5.28 U5.B28
N$77
  Top 0.61: U5.27 U5.B27
N$78
  Top 0.61: U5.24 U5.B24
N$79
  Top 0.61: U5.23 U5.B23
N$80
  Top 0.61: U5.22 U5.B22
N$81
  Top 0.61: L1.P$2 9.89,35.32 C22.1
  Top 1.27: C22.1 9.88,28.74 PS1.2
N$82
  Top 0.61: U6.21 U6.B21
N$83
  Top 0.61: U6.B19 U6.19
N$84
  Top 0.61: U6.B17 U6.17
N$85
  Top 0.61: U6.B16 U6.16
N$86
  Top 0.61: U6.B15 U6.15
N$87
  Top 0.61: U6.B14 U6.14
N$88
  Top 0.61: U6.B38 U6.38 244.09,34.67 U6.37 U6.B37
N$89
  Top 0.406: U3.B5 U3.5
N$90
  Top 0.61: U6.34 U6.B34
N$91
  Top 0.61: U6.33 U6.B33
N$92
  Top 0.61: U6.32 U6.B32
N$93
  Top 0.61: U6.28 U6.B28
N$94
  Top 0.61: U6.27 U6.B27
N$95
  Top 0.61: U6.24 U6.B24
N$96
  Top 0.61: U6.23 U6.B23
N$97
  Top 0.61: U6.22 U6.B22
N$98
  Top 0.61: U8.21 U8.B21
N$99
  Top 0.61: U8.B19 U8.19
N$100
  Top 0.61: U8.B17 U8.17
N$101
  Top 0.61: U8.B16 U8.16
N$102
  Top 0.61: U8.B15 U8.15
N$103
  Top 0.61: U8.B14 U8.14
N$104
  Top 0.61: U8.B38 U8.38 246.38,7.37 245.36,8.38 243.84,8.38 | U8.B37 U8.37 243.84,8.38 | U8.B35 U8.35 240.03,8 240.03,8.38 243.84,8.38
N$105
  Top 0.406: U3.B6 U3.6
N$106
  Top 0.406: U3.B7 U3.7
N$108
  Top 0.61: U8.34 U8.B34
N$109
  Top 0.61: U8.33 U8.B33
N$110
  Top 0.61: U8.32 U8.B32
N$111
  Top 0.61: U8.28 U8.B28
N$112
  Top 0.61: U8.27 U8.B27
N$113
  Top 0.61: U8.24 U8.B24
N$114
  Top 0.61: U8.23 U8.B23
N$115
  Top 0.61: U8.22 205.74,4.57 205.99,4.32 205.99,4.19 U8.B22
N$116
  Top 0.406: U4.B2 U4.2
N$117
  Top 0.406: U4.B3 U4.3
N$118
  Top 0.406: U4.B4 U4.4
N$119
  Top 0.406: U4.B5 U4.5
N$120
  Top 0.406: U4.B6 U4.6
N$121
  Top 0.406: U4.B7 U4.7
N$123
  Top 0.406: U5.B2 U5.2
N$124
  Top 0.406: U5.B3 U5.3
N$125
  Top 0.406: U5.B4 U5.4
N$126
  Top 0.406: U5.B5 U5.5
N$127
  Top 0.406: U5.B6 U5.6
N$128
  Top 0.406: U5.B7 U5.7
N$130
  Top 0.406: U6.B2 U6.2
N$131
  Top 0.406: U6.B3 U6.3
N$132
  Top 0.406: U6.B4 U6.4
N$133
  Top 0.406: U6.B5 U6.5
N$134
  Top 0.406: U6.B6 U6.6
N$135
  Top 0.406: U6.B7 U6.7
N$136
  Top 0.406: U8.B2 U8.2
N$137
  Top 0.406: U8.B3 U8.3
N$138
  Top 0.406: U8.B4 U8.4
N$139
  Top 0.406: U8.B5 U8.5
N$140
  Bottom 0.406: U8.B6 U8.6
N$141
  Bottom 0.406: U8.B7 U8.7
OUT1
  Top 0.61: 44.7,47.75 C25.1 | U7.18 U7.B18
  Top 0.813: U7.18 44.7,47.75
OUT2
  Top 0.305: U3.18 U3.B18
  Top 0.61: U3.18 44.7,18.26 C21.1
OUT3
  Top 0.61: C26.1 138.43,50.16 U4.18 U4.B18
OUT4
  Top 0.61: C27.1 138.18,19.79 U5.18 U5.B18
OUT5
  Top 0.61: C29.1 U6.18 U6.B18
OUT6
  Top 0.61: C31.1 U8.18 U8.B18
PA1_SD_DETECT  (via drill 0.35)
  Top 0.305: v67.31,10.41 65.02,8.12 U3.31
  Top 0.508: 65.02,33.78 69.98,38.73 v70.23,38.73 | 104.05,42.25 103.38,42.93 v102.11,42.93
  Top 0.61: 65.02,33.78 U7.31 U7.B31 | J2.9 104.05,42.25 | U3.31 U3.B31
  Bottom 0.305: U7.B31 67.69,27.94 90.93,27.94 92.2,26.67 92.2,19.56 84.07,11.43 72.64,11.43 71.63,10.41 v67.31,10.41
  Bottom 0.508: v70.23,38.73 72.01,38.73 72.14,38.61 92.15,38.61 94.05,40.5 99.94,40.5 102.11,42.67 v102.11,42.93
PA1_SD_DETECT1
  Top 0.61: U4.31 U4.B31
PULLUPED
  Top 0.61: U5.38 U5.B38 174.62,3.3 172.85,3.3 U5.B36 | U5.36 U5.B36 | U5.35 U5.B35 168.91,4.95 U5.B36
PULLUPED2
  Top 0.61: U4.B38 U4.38 176.28,36.58 175.77,37.08 172.21,37.08 171.2,36.07 U4.36 U4.B36
SCLK_2  (via drill 0.35)
  Top 0.254: U8.9 U8.B9 231.14,26.67 234.19,29.72 253.49,29.72 254.76,30.99 254.76,36.58 250.95,40.39 238.25,40.39 231.14,47.5 U6.9 U6.B9
  Top 0.305: U4.9 161.04,49.53 167.13,43.43 178.82,43.43 185.3,36.96 185.42,31.5 182.88,28.96 163.32,28.96 161.04,26.67 U5.B9 | U5.9 163.96,19.81 183.39,19.81 190.75,27.18 v216.41,27.18 | U7.9 69.6,46.1 69.6,40.64 74.17,36.07 87.12,36.07 90.17,33.02 v90.17,30.73 90.17,30.48 87.88,28.19 69.34,28.19 67.56,26.42 U3.B9 | v158.5,41.4 154.43,37.34 123.95,37.34 118.36,31.75 98.81,31.75 94.49,27.43 v94.36,27.56
  Top 0.61: U7.B9 U7.9 | U3.B9 U3.9 | U5.B9 U5.9 | U4.B9 U4.9
  Bottom 0.305: X1.10 22.86,10.41 29.72,17.27 29.72,29.21 37.34,36.83 50.59,36.83 51.79,38.02 59.61,38.02 67.56,45.97 U7.9 | v216.41,27.18 224.45,27.18 225.47,26.16 230.38,26.16 231.14,25.4 U8.B9 | U4.9 161.04,43.94 v158.5,41.4 | v94.36,27.56 93.34,27.56 v90.17,30.73
SD_CLK
  Top 0.61: R32.1 U7.7 U7.B7
SD_CMD
  Top 0.305: U7.B6 U7.6
  Top 0.61: R31.1 U7.6 R95.1
SD_DAT0
  Top 0.61: R33.1 U7.5 U7.B5 R94.1
SD_DAT1
  Top 0.61: R34.1 U7.4 U7.B4 R93.1
SD_DAT2
  Top 0.61: R29.1 U7.3 U7.B3 R97.1
SD_DAT3
  Top 0.61: R30.1 U7.2 U7.B2 R96.1
SPI6_CLK
  Top 0.305: U8.B29 221.36,2.03 155.7,2.03 153.67,4.06 153.67,4.95 U5.B29 153.42,5.08 153.42,4.32 151.89,2.79 150.37,2.79 149.86,2.29 131.32,2.29 122.17,11.43 64.26,11.43 59.94,7.11 U3.29
  Top 0.61: U7.29 U7.B29 | U3.29 U3.B29 | U5.29 153.42,5.08 | U4.29 U4.B29 | U6.29 U6.B29
  Top 0.813: U8.29 U8.B29
  Bottom 0.254: U8.B29 223.52,7.37 228.09,11.94 252.48,11.94 255.02,14.48 255.02,25.4 252.98,27.43 227.08,27.43 223.52,30.99 U6.B29
  Bottom 0.305: X1.6 17.78,7.37 16.51,6.1 16.51,3.56 18.54,1.52 57.53,1.52 U3.B29 | U5.29 153.42,8.38 158.75,13.72 177.55,13.72 184.38,20.55 184.38,27.2 182.88,28.7 155.96,28.7 153.42,31.24 U4.B29 | U7.B29 60.96,29.59 60.96,28.45 62.99,26.42 89.15,26.42 90.17,25.4 90.17,20.57 83.82,14.22 67.31,14.22 59.94,6.86 U3.29
SPI6_MOSI  (via drill 0.35)
  Top 0.305: U3.25 49.78,7.87 54.1,12.19 120.65,12.19 | U5.25 141.48,9.53 125.73,9.53 123.06,12.19 120.65,12.19 | 120.65,12.19 107.19,25.65 106.43,25.65 v106.43,25.91
  Top 0.61: U7.25 U7.B25 | U5.25 U5.B25 | U4.25 U4.B25
  Top 0.813: U3.25 U3.B25
  Bottom 0.254: U8.B25 U8.25 214.88,8.26 223.01,8.26 227.71,12.95 251.46,12.95 254,15.49 254,25.15 252.22,26.92 226.19,26.92 223.01,30.1 215.65,30.1 U6.B25 U6.25
  Bottom 0.305: U3.B25 48.13,2.29 22.86,2.29 21.65,3.5 21.65,6.54 20.57,7.62 X1.8 | U5.25 150.75,15.24 177.29,15.24 183.39,21.34 183.39,26.67 182.37,27.69 155.32,27.69 152.4,30.61 145.29,30.61 U4.B25 | U8.B25 213.36,3.3 212.09,2.03 144.78,2.03 143.26,3.56 U5.B25 | v106.43,25.91 103.38,28.96 96.01,28.96 90.17,34.8 53.12,34.8 52.74,34.42 51.05,34.42 U7.25
SPI6_NSS  (via drill 0.35)
  Top 0.254: U8.B30 U8.30
  Top 0.305: v58.93,39.88 62.48,36.32 U7.30 | U8.30 226.06,6.6 224.54,8.13 189.99,8.13 189.23,7.37 185.93,7.37 182.88,10.41 157.73,10.41 156.34,9.02 | U5.30 155.96,8.64 156.34,9.02 | v143.26,10.67 143.76,10.16 155.19,10.16 156.34,9.02
  Top 0.61: U7.30 U7.B30 | U3.30 U3.B30 | U4.30 U4.B30 | U6.30 U6.B30
  Bottom 0.254: U8.30 226.06,7.62 229.36,10.92 252.98,10.92 256.03,13.97 256.03,25.65 253.75,27.94 229.87,27.94 226.06,31.75 U6.B30
  Bottom 0.305: X1.5 19.05,6.35 19.05,8.64 28.45,18.03 28.45,29.21 36.83,37.59 49.78,37.59 51.31,39.12 58.17,39.12 v58.93,39.88 | U5.B30 U5.30 155.96,9.65 158.5,12.19 178.05,12.19 185.67,19.81 185.67,27.43 183.39,29.72 157.48,29.72 155.96,31.24 U4.B30 | 64.01,9.4 141.99,9.4 v143.26,10.67 | 64.01,9.4 62.48,7.87 U3.30 | U7.B30 62.23,30.1 62.23,28.45 63.5,27.18 90.42,27.18 91.19,26.42 91.19,19.81 84.59,13.21 67.82,13.21 64.01,9.4
SS_2  (via drill 0.35)
  Top 0.254: U6.8 233.68,47.24 239.27,41.66 251.46,41.66 255.78,37.34 255.78,30.73 254,28.96 v235.2,28.96 233.68,27.43 U8.B8 U8.8
  Top 0.305: U6.B8 U6.8 | U4.8 163.58,49.53 167.39,45.72 178.31,45.72 186.73,37.38 186.71,30.5 183.9,27.69 165.1,27.69 163.58,26.16 163.58,23.11 U5.8 165.74,20.83 182.12,20.83 189.23,27.94 227.84,27.94 v229.62,29.72 | U7.8 70.61,47.88 70.61,40.64 74.42,36.83 87.88,36.83 91.44,33.27 v91.44,31.5 91.44,29.97 88.9,27.43 71.37,27.43 70.1,26.16 U3.B8 | v135.64,29.72 99.82,29.72 v97.79,27.69
  Top 0.61: U7.B8 U7.8 | U3.B8 U3.8
  Top 0.813: U5.B8 163.58,23.11
  Bottom 0.305: X1.9 24.64,3.3 33.27,3.3 38.28,8.31 58.77,8.31 63.58,13.12 63.58,14.43 70.1,20.95 | v235.2,28.96 234.7,28.96 233.93,29.72 v229.62,29.72 | U5.B8 162.18,26.92 154.69,26.92 151.89,29.72 v135.64,29.72 | v97.79,27.69 95.76,27.69 92.2,31.24 91.44,31.24 v91.44,31.5
  Bottom 0.61: 70.1,20.95 U3.8 | U4.B8 U4.8

### Text on the board
tPlace: G | H